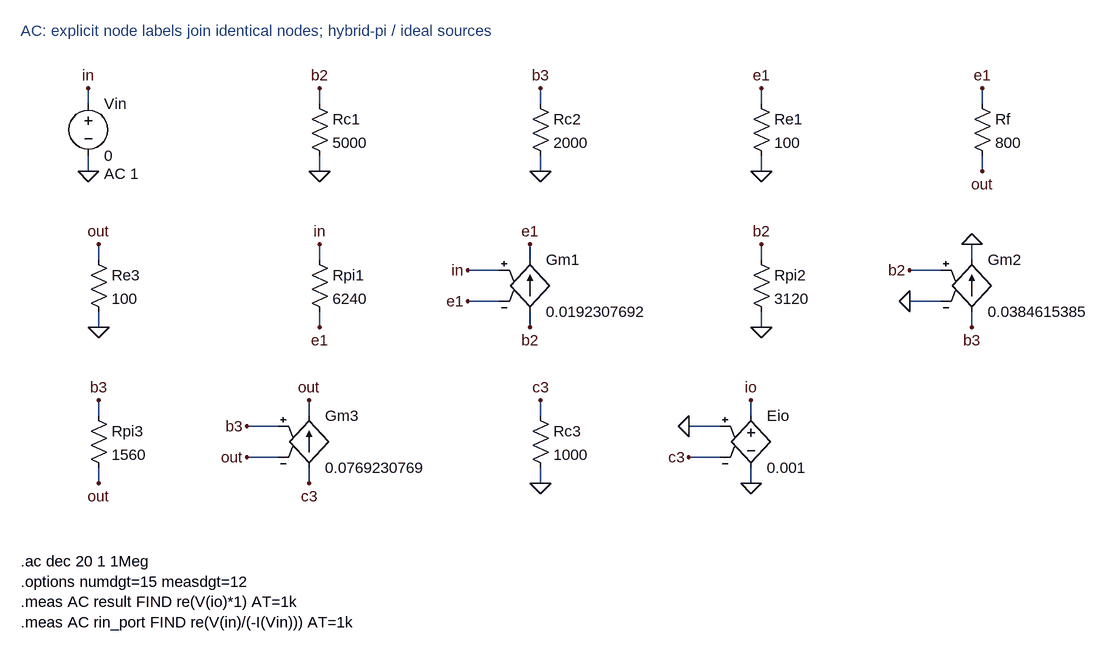
[diagram p0: schematic AC.asc]
AC.asc, the LTspice schematic file:
Version 4
SHEET 1 1800 1500
TEXT 16 -48 Left 2 ;AC: explicit node labels join identical nodes; hybrid-pi / ideal sources
WIRE 120 64 120 40
FLAG 120 40 in
WIRE 120 144 120 168
FLAG 120 168 0
SYMBOL voltage 120 48 R0
SYMATTR InstName Vin
WINDOW 123 24 124 Left 2
SYMATTR Value 0
SYMATTR Value2 AC 1
WIRE 476 64 476 40
FLAG 476 40 b2
WIRE 476 144 476 168
FLAG 476 168 0
SYMBOL res 460 48 R0
SYMATTR InstName Rc1
SYMATTR Value 5000
WIRE 816 64 816 40
FLAG 816 40 b3
WIRE 816 144 816 168
FLAG 816 168 0
SYMBOL res 800 48 R0
SYMATTR InstName Rc2
SYMATTR Value 2000
WIRE 1156 64 1156 40
FLAG 1156 40 e1
WIRE 1156 144 1156 168
FLAG 1156 168 0
SYMBOL res 1140 48 R0
SYMATTR InstName Re1
SYMATTR Value 100
WIRE 1496 64 1496 40
FLAG 1496 40 e1
WIRE 1496 144 1496 168
FLAG 1496 168 out
SYMBOL res 1480 48 R0
SYMATTR InstName Rf
SYMATTR Value 800
WIRE 136 304 136 280
FLAG 136 280 out
WIRE 136 384 136 408
FLAG 136 408 0
SYMBOL res 120 288 R0
SYMATTR InstName Re3
SYMATTR Value 100
WIRE 476 304 476 280
FLAG 476 280 in
WIRE 476 384 476 408
FLAG 476 408 e1
SYMBOL res 460 288 R0
SYMATTR InstName Rpi1
SYMATTR Value 6240
WIRE 800 384 800 408
FLAG 800 408 b2
WIRE 800 304 800 280
FLAG 800 280 e1
WIRE 752 320 704 320
FLAG 704 320 in
WIRE 752 368 704 368
FLAG 704 368 e1
SYMBOL g 800 288 R0
SYMATTR InstName Gm1
SYMATTR Value 0.0192307692
WIRE 1156 304 1156 280
FLAG 1156 280 b2
WIRE 1156 384 1156 408
FLAG 1156 408 0
SYMBOL res 1140 288 R0
SYMATTR InstName Rpi2
SYMATTR Value 3120
WIRE 1480 384 1480 408
FLAG 1480 408 b3
WIRE 1480 304 1480 280
FLAG 1480 280 0
WIRE 1432 320 1384 320
FLAG 1384 320 b2
WIRE 1432 368 1384 368
FLAG 1384 368 0
SYMBOL g 1480 288 R0
SYMATTR InstName Gm2
SYMATTR Value 0.0384615385
WIRE 136 544 136 520
FLAG 136 520 b3
WIRE 136 624 136 648
FLAG 136 648 out
SYMBOL res 120 528 R0
SYMATTR InstName Rpi3
SYMATTR Value 1560
WIRE 460 624 460 648
FLAG 460 648 c3
WIRE 460 544 460 520
FLAG 460 520 out
WIRE 412 560 364 560
FLAG 364 560 b3
WIRE 412 608 364 608
FLAG 364 608 out
SYMBOL g 460 528 R0
SYMATTR InstName Gm3
SYMATTR Value 0.0769230769
WIRE 816 544 816 520
FLAG 816 520 c3
WIRE 816 624 816 648
FLAG 816 648 0
SYMBOL res 800 528 R0
SYMATTR InstName Rc3
SYMATTR Value 1000
WIRE 1140 544 1140 520
FLAG 1140 520 io
WIRE 1140 624 1140 648
FLAG 1140 648 0
WIRE 1092 560 1044 560
FLAG 1044 560 0
WIRE 1092 608 1044 608
FLAG 1044 608 c3
SYMBOL e 1140 528 R0
SYMATTR InstName Eio
SYMATTR Value 0.001
TEXT 16 768 Left 2 !.ac dec 20 1 1Meg\n.options numdgt=15 measdgt=12\n.meas AC result FIND re(V(io)*1) AT=1k\n.meas AC rin_port FIND re(V(in)/(-I(Vin))) AT=1k

The netlist it stands for:
* AC.asc
Vin in 0 0 AC 1
Rc1 b2 0 5000
Rc2 b3 0 2000
Re1 e1 0 100
Rf e1 out 800
Re3 out 0 100
Rpi1 in e1 6240
Gm1 b2 e1 in e1 0.0192307692
Rpi2 b2 0 3120
Gm2 b3 0 b2 0 0.0384615385
Rpi3 b3 out 1560
Gm3 c3 out b3 out 0.0769230769
Rc3 c3 0 1000
Eio io 0 0 c3 0.001
* AC: explicit node labels join identical nodes; hybrid-pi / ideal sources
.ac dec 20 1 1Meg
.options numdgt=15 measdgt=12
.meas AC result FIND re(V(io)*1) AT=1k
.meas AC rin_port FIND re(V(in)/(-I(Vin))) AT=1k
.backanno
.end

* Results of the author's LTspice run, read from the files saved beside the schematic
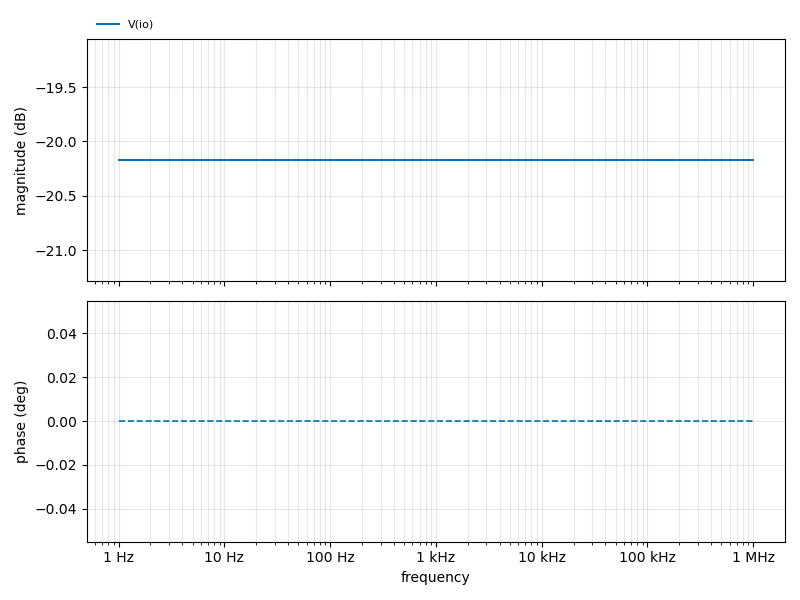
[diagram p1: AC Analysis of AC.asc, plotted from the saved traces]
* AC Analysis, 1 run:
*   V(io): -20.17 dB at 1 Hz, -20.17 dB at 1 MHz, peak -20.17 dB at 1 Hz
* From the log:
*   result: re(V(io)*1)=(-20.1717111295dB,0°) at 1000
*   rin_port: re(V(in)/(-I(Vin)))=(123.533515697dB,0°) at 1000